# EAGLE schematic schematic (EAGLE 8.3.1)
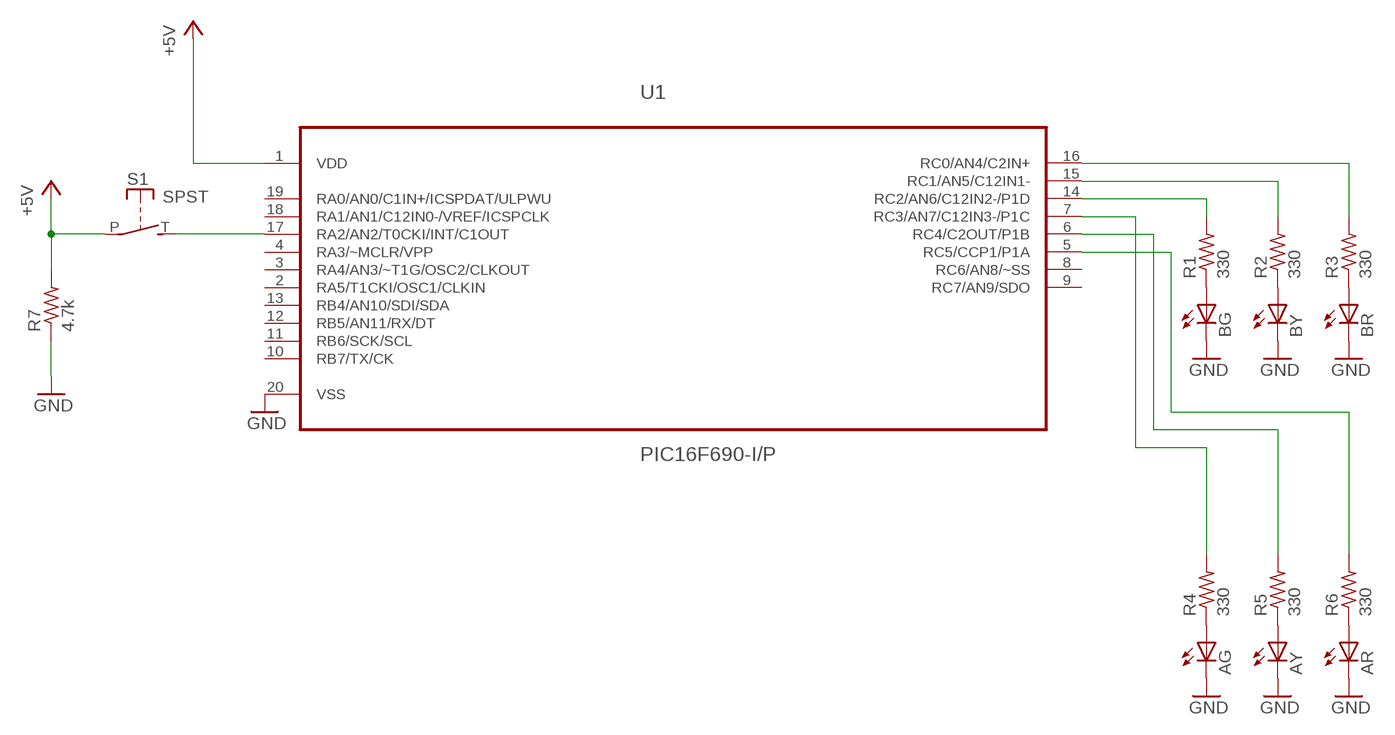
[diagram p0: schematic, sheet 1]

## Parts
AG  LED5MM  [LED5MM]
AR  LED5MM  [LED5MM]
AY  LED5MM  [LED5MM]
BG  LED5MM  [LED5MM]
BR  LED5MM  [LED5MM]
BY  LED5MM  [LED5MM]
R1  330  R-US_0204/5  [0204/5]
R2  330  R-US_0204/5  [0204/5]
R3  330  R-US_0204/5  [0204/5]
R4  330  R-US_0204/5  [0204/5]
R5  330  R-US_0204/5  [0204/5]
R6  330  R-US_0204/5  [0204/5]
R7  4.7k  R-US_0204/5  [0204/5]
S1  SPST  [JUDCOSPST]
U1  PIC16F690-I/P  [DIP254P762X533-20]

## Nets
+5V: R7.2 S1.P U1.1(VDD)
GND: AG.K(C) AR.K(C) AY.K(C) BG.K(C) BR.K(C) BY.K(C) R7.1 U1.20(VSS)
N$1: BG.A R1.1
N$2: BY.A R2.1
N$3: BR.A R3.1
N$4: R3.2 U1.16(RC0/AN4/C2IN+)
N$5: R2.2 U1.15(RC1/AN5/C12IN1-)
N$6: R1.2 U1.14(RC2/AN6/C12IN2-/P1D)
N$7: AR.A R6.1
N$8: AY.A R5.1
N$9: AG.A R4.1
N$10: R6.2 U1.5(RC5/CCP1/P1A)
N$11: R5.2 U1.6(RC4/C2OUT/P1B)
N$12: R4.2 U1.7(RC3/AN7/C12IN3-/P1C)
N$13: S1.T(S) U1.17(RA2/AN2/T0CKI/INT/C1OUT)
Unconnected: U1.2(RA5/T1CKI/OSC1/CLKIN) U1.3(RA4/AN3/~T1G/OSC2/CLKOUT) U1.4(RA3/~MCLR/VPP) U1.8(RC6/AN8/~SS) U1.9(RC7/AN9/SDO) U1.10(RB7/TX/CK) U1.11(RB6/SCK/SCL) U1.12(RB5/AN11/RX/DT) U1.13(RB4/AN10/SDI/SDA) U1.18(RA1/AN1/C12IN0-/VREF/ICSPCLK) U1.19(RA0/AN0/C1IN+/ICSPDAT/ULPWU)

## Library data of the parts
AG AR AY BG BR BY = adafruit:LED: LED OSRAM: - CHIPLED LG R971, LG N971, LY N971, LG Q971, LY Q971, LO R971, LY R971 LH N974, LH R974 LS Q976, LO Q976, LY Q976 LO Q996 - Hyper CHIPLED LW Q18S LB Q993, LB Q99A, LB R99A - SideLED LS A670, LO A670, LY A670, LG A670, LP A670 LB A673, LV A673, LT A673, LW A673 LH A674 LY A675 LS A676, LA A676, LO A676, LY A676, LW A676 LS A679, LY A679, LG A679 - Hyper Micro SIDELED® LS Y876, LA Y876, LO Y876, LY Y876 LT Y87S - SmartLED LW L88C, LW L88S LB L89C, LB L89S, LG L890 LS L89K, LO L89K, LY L89K LS L896, LA L896, LO L896, LY L896 - TOPLED LS T670, LO T670, LY T670, LG T670, LP T670 LSG T670, LSP T670, LSY T670, LOP T670, LYG T670 LG T671, LOG T671, LSG T671 LB T673, LV T673, LT T673, LW T673 LH T674 LS T676, LA T676, LO T676, LY T676, LB T676, LH T676, LSB T676, LW T676 LB T67C, LV T67C, LT T67C, LS T67K, LO T67K, LY T67K, LW E67C LS E67B, LA E67B, LO E67B, LY E67B, LB E67C, LV E67C, LT E67C LW T67C LS T679, LY T679, LG T679 LS T770, LO T770, LY T770, LG T770, LP T770 LB T773, LV T773, LT T773, LW T773 LH T774 LS E675, LA E675, LY E675, LS T675 LS T776, LA T776, LO T776, LY T776, LB T776 LHGB T686 LT T68C, LB T68C - Hyper Mini TOPLED® LB M676 - Mini TOPLED Santana® LG M470 LS M47K, LO M47K, LY M47K Source: http://www.osram.convergy.de/
R1-R7 = adafruit:R-US_: RESISTOR, American symbol
S1 = adafruit:SPST: Judco 50-0015-00
U1 = PIC16F690-I_P:PIC16F690-I/P: CMOS Microcontrollers; AVAILABILITY: Unavailable; DESCRIPTION: PIC16 Series 256 B RAM 4 kB Flash 8-Bit CMOS Microcontroller - PDIP-20; MF: Microchip; MP: PIC16F690-I/P; PACKAGE: DIP-20 Microchip; PRICE: None